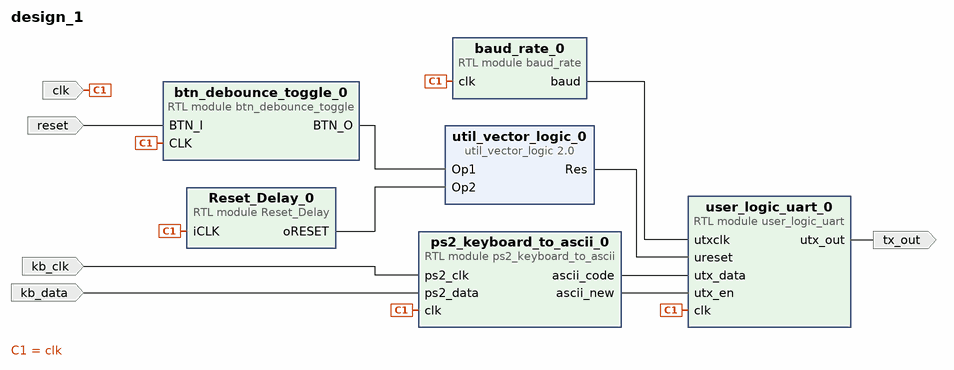
[diagram p0: block diagram of the top level]
# Vivado block design design_1, xc7z007sclg400-1, Vivado 2019.1
create_bd_design design_1

create_bd_port -dir I clk
create_bd_port -dir I reset
create_bd_port -dir O tx_out
create_bd_port -dir I kb_clk
create_bd_port -dir I kb_data

create_bd_cell -type ip -vlnv xilinx.com:ip:util_vector_logic:2.0 util_vector_logic_0
set_property -dict {CONFIG.C_SIZE 1} [get_bd_cells util_vector_logic_0]
create_bd_cell -type module -reference ps2_keyboard_to_ascii ps2_keyboard_to_ascii_0
create_bd_cell -type module -reference Reset_Delay Reset_Delay_0
create_bd_cell -type module -reference btn_debounce_toggle btn_debounce_toggle_0
create_bd_cell -type module -reference baud_rate baud_rate_0
create_bd_cell -type module -reference user_logic_uart user_logic_uart_0

# ---- connections ----

connect_bd_net [get_bd_ports clk] \
  [get_bd_pins ps2_keyboard_to_ascii_0/clk] [get_bd_pins Reset_Delay_0/iCLK] [get_bd_pins btn_debounce_toggle_0/CLK] \
  [get_bd_pins baud_rate_0/clk] [get_bd_pins user_logic_uart_0/clk]
connect_bd_net [get_bd_pins Reset_Delay_0/oRESET] [get_bd_pins util_vector_logic_0/Op2]
connect_bd_net [get_bd_pins util_vector_logic_0/Res] [get_bd_pins user_logic_uart_0/ureset]
connect_bd_net [get_bd_pins baud_rate_0/baud] [get_bd_pins user_logic_uart_0/utxclk]
connect_bd_net [get_bd_pins user_logic_uart_0/utx_out] [get_bd_ports tx_out]
connect_bd_net [get_bd_pins ps2_keyboard_to_ascii_0/ascii_code] [get_bd_pins user_logic_uart_0/utx_data]
connect_bd_net [get_bd_pins ps2_keyboard_to_ascii_0/ascii_new] [get_bd_pins user_logic_uart_0/utx_en]
connect_bd_net [get_bd_ports kb_clk] [get_bd_pins ps2_keyboard_to_ascii_0/ps2_clk]
connect_bd_net [get_bd_ports kb_data] [get_bd_pins ps2_keyboard_to_ascii_0/ps2_data]
connect_bd_net [get_bd_ports reset] [get_bd_pins btn_debounce_toggle_0/BTN_I]
connect_bd_net [get_bd_pins btn_debounce_toggle_0/BTN_O] [get_bd_pins util_vector_logic_0/Op1]

validate_bd_design
save_bd_design
